# Altium project Arm_Control.PrjPcb
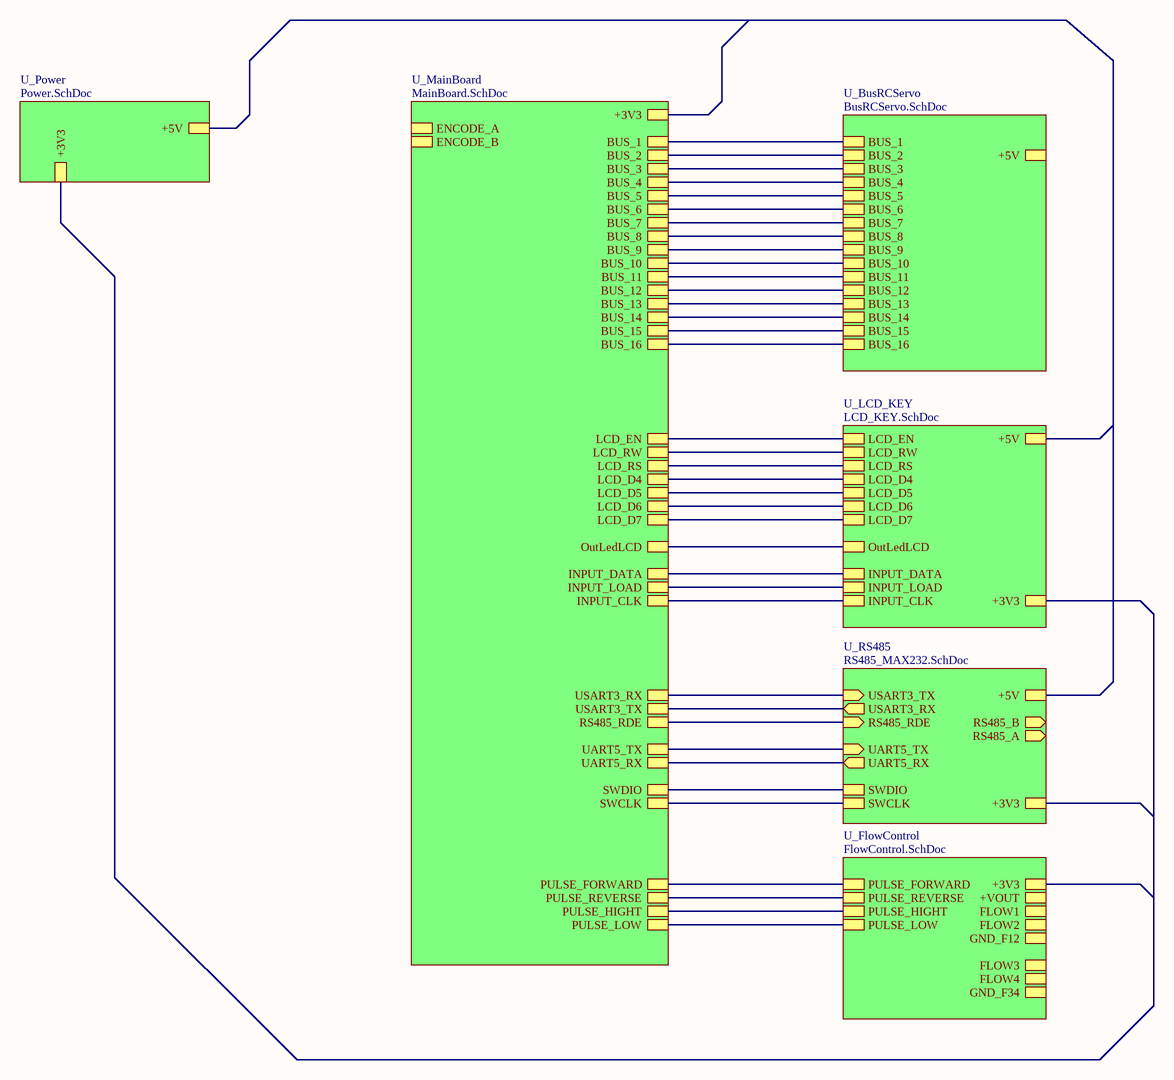
[diagram p0: ArmControl.SchDoc]
7 sheets, 117 parts. Net scope: hierarchical (ports join the sheet entries above them; power ports are global).
Sheets:
  ArmControl.SchDoc
    U_BusRCServo = BusRCServo.SchDoc
    U_Power = Power.SchDoc
    U_LCD_KEY = LCD_KEY.SchDoc
    U_FlowControl = FlowControl.SchDoc
    U_MainBoard = MainBoard.SchDoc
    U_RS485 = RS485_MAX232.SchDoc

## Sheet ArmControl.SchDoc
size B; SheetNumber: 1; SheetTotal: 8

### Sub-sheets
U_BusRCServo = BusRCServo.SchDoc: BUS_1, BUS_2, BUS_3, BUS_4, BUS_5, BUS_6, BUS_7, BUS_8, BUS_9, BUS_10, BUS_11, BUS_12, BUS_13, BUS_14, BUS_15, BUS_16, +5V
U_FlowControl = FlowControl.SchDoc: +3V3, +VOUT, PULSE_FORWARD, FLOW2, GND_F12, FLOW1, PULSE_REVERSE, PULSE_HIGHT, FLOW4, GND_F34, FLOW3, PULSE_LOW
U_LCD_KEY = LCD_KEY.SchDoc: LCD_EN, LCD_RW, LCD_RS, LCD_D4, LCD_D5, LCD_D6, LCD_D7, +5V, OutLedLCD, +3V3, INPUT_DATA, INPUT_LOAD, INPUT_CLK
U_MainBoard = MainBoard.SchDoc: ENCODE_A, ENCODE_B, BUS_5, BUS_6, BUS_2, BUS_3, BUS_4, BUS_11, BUS_12, BUS_9, BUS_10, BUS_13, BUS_14, BUS_15, BUS_16, BUS_1, BUS_7, BUS_8, LCD_D4, LCD_D5, LCD_D6, LCD_D7, LCD_EN, LCD_RW, LCD_RS, INPUT_DATA, INPUT_LOAD, INPUT_CLK, SWDIO, SWCLK, +3V3, RS485_RDE, USART3_RX, USART3_TX, PULSE_LOW, OutLedLCD, PULSE_HIGHT, PULSE_REVERSE, PULSE_FORWARD, UART5_TX, UART5_RX
U_Power = Power.SchDoc: +3V3, +5V
U_RS485 = RS485_MAX232.SchDoc: USART3_RX (out), USART3_TX (in), RS485_A (out), RS485_B (out), RS485_RDE (in), +5V, SWCLK, UART5_RX (out), UART5_TX (in), SWDIO, +3V3

### Nets
+3V3: sheet U_Power/+3V3, sheet U_LCD_KEY/+3V3, sheet U_FlowControl/+3V3, sheet U_MainBoard/+3V3, sheet U_RS485/+3V3
+5V: sheet U_BusRCServo/+5V, sheet U_Power/+5V, sheet U_LCD_KEY/+5V, sheet U_RS485/+5V
NetJP?_5: sheet U_MainBoard/SWDIO, sheet U_RS485/SWDIO
NetJP?_6: sheet U_MainBoard/SWCLK, sheet U_RS485/SWCLK
NetP1_2: sheet U_LCD_KEY/INPUT_CLK, sheet U_MainBoard/INPUT_CLK
NetP1_3: sheet U_LCD_KEY/INPUT_LOAD, sheet U_MainBoard/INPUT_LOAD
NetP1_4: sheet U_LCD_KEY/INPUT_DATA, sheet U_MainBoard/INPUT_DATA
NetP2_1: sheet U_BusRCServo/BUS_1, sheet U_MainBoard/BUS_1
NetP2_2: sheet U_BusRCServo/BUS_4, sheet U_MainBoard/BUS_4
NetP2_7: sheet U_BusRCServo/BUS_2, sheet U_MainBoard/BUS_2
NetP2_8: sheet U_BusRCServo/BUS_5, sheet U_MainBoard/BUS_5
NetP2_13: sheet U_BusRCServo/BUS_3, sheet U_MainBoard/BUS_3
NetP2_14: sheet U_BusRCServo/BUS_6, sheet U_MainBoard/BUS_6
NetP3_1: sheet U_BusRCServo/BUS_7, sheet U_MainBoard/BUS_7
NetP3_2: sheet U_BusRCServo/BUS_10, sheet U_MainBoard/BUS_10
NetP3_7: sheet U_BusRCServo/BUS_8, sheet U_MainBoard/BUS_8
NetP3_8: sheet U_BusRCServo/BUS_11, sheet U_MainBoard/BUS_11
NetP3_13: sheet U_BusRCServo/BUS_9, sheet U_MainBoard/BUS_9
NetP3_14: sheet U_BusRCServo/BUS_12, sheet U_MainBoard/BUS_12
NetP4_1: sheet U_BusRCServo/BUS_13, sheet U_MainBoard/BUS_13
NetP4_2: sheet U_BusRCServo/BUS_16, sheet U_MainBoard/BUS_16
NetP4_7: sheet U_BusRCServo/BUS_14, sheet U_MainBoard/BUS_14
NetP4_13: sheet U_BusRCServo/BUS_15, sheet U_MainBoard/BUS_15
NetPLCD1_1: sheet U_LCD_KEY/LCD_EN, sheet U_MainBoard/LCD_EN
NetPLCD1_2: sheet U_LCD_KEY/LCD_RW, sheet U_MainBoard/LCD_RW
NetPLCD1_3: sheet U_LCD_KEY/LCD_RS, sheet U_MainBoard/LCD_RS
NetPLCD2_3: sheet U_LCD_KEY/LCD_D7, sheet U_MainBoard/LCD_D7
NetPLCD2_4: sheet U_LCD_KEY/LCD_D6, sheet U_MainBoard/LCD_D6
NetPLCD2_5: sheet U_LCD_KEY/LCD_D5, sheet U_MainBoard/LCD_D5
NetPLCD2_6: sheet U_LCD_KEY/LCD_D4, sheet U_MainBoard/LCD_D4
NetR23_1: sheet U_LCD_KEY/OutLedLCD, sheet U_MainBoard/OutLedLCD
NetR43_1: sheet U_MainBoard/USART3_TX, sheet U_RS485/USART3_RX
NetR44_1: sheet U_MainBoard/USART3_RX, sheet U_RS485/USART3_TX
NetR50_2: sheet U_MainBoard/UART5_RX, sheet U_RS485/UART5_RX
NetR51_1: sheet U_MainBoard/UART5_TX, sheet U_RS485/UART5_TX
NetU1_29: sheet U_FlowControl/PULSE_FORWARD, sheet U_MainBoard/PULSE_FORWARD
NetU1_30: sheet U_FlowControl/PULSE_REVERSE, sheet U_MainBoard/PULSE_REVERSE
NetU1_33: sheet U_FlowControl/PULSE_HIGHT, sheet U_MainBoard/PULSE_HIGHT
NetU1_34: sheet U_FlowControl/PULSE_LOW, sheet U_MainBoard/PULSE_LOW
NetU1_55: sheet U_MainBoard/RS485_RDE, sheet U_RS485/RS485_RDE

## Sheet BusRCServo.SchDoc
size A; SheetNumber: 6; SheetTotal: 8
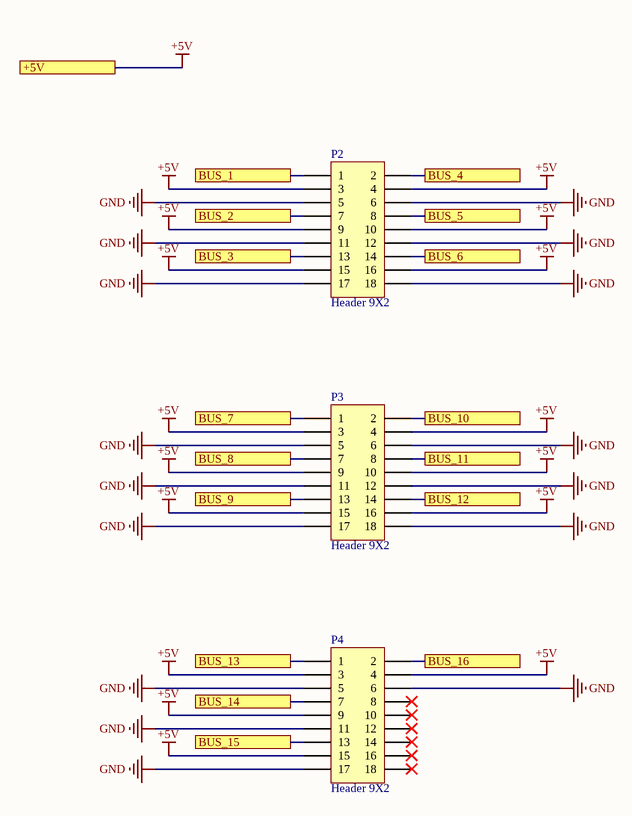
[diagram p1: BusRCServo.SchDoc]

### Parts
P2  Header 9X2  [HDR2X9]
P3  Header 9X2  [HDR2X9]
P4  Header 9X2  [HDR2X9]

### Ports
+5V, BUS_1, BUS_2, BUS_3, BUS_4, BUS_5, BUS_6, BUS_7, BUS_8, BUS_9, BUS_10, BUS_11, BUS_12, BUS_13, BUS_14, BUS_15, BUS_16

### Nets
+5V: P2.3 P2.4 P2.9 P2.10 P2.15 P2.16 P3.3 P3.4 P3.9 P3.10 P3.15 P3.16 P4.3 P4.4 P4.9 P4.15 ; port +5V
GND: P2.5 P2.6 P2.11 P2.12 P2.17 P2.18 P3.5 P3.6 P3.11 P3.12 P3.17 P3.18 P4.5 P4.6 P4.11 P4.17
NetP2_1: P2.1 ; port BUS_1
NetP2_2: P2.2 ; port BUS_4
NetP2_7: P2.7 ; port BUS_2
NetP2_8: P2.8 ; port BUS_5
NetP2_13: P2.13 ; port BUS_3
NetP2_14: P2.14 ; port BUS_6
NetP3_1: P3.1 ; port BUS_7
NetP3_2: P3.2 ; port BUS_10
NetP3_7: P3.7 ; port BUS_8
NetP3_8: P3.8 ; port BUS_11
NetP3_13: P3.13 ; port BUS_9
NetP3_14: P3.14 ; port BUS_12
NetP4_1: P4.1 ; port BUS_13
NetP4_2: P4.2 ; port BUS_16
NetP4_7: P4.7 ; port BUS_14
NetP4_13: P4.13 ; port BUS_15

Not connected (* = marked no-connect by the designer): P4 8* 10* 12* 14* 16* 18*

### Library data of the parts
P2-P4 = Header 9X2: Header, 9-Pin, Dual row; LatestRevisionDate: 17-Jul-2002; LatestRevisionNote: Re-released for DXP Platform.; Publisher: Altium Limited

## Sheet Power.SchDoc
size A; SheetNumber: 3; SheetTotal: 7
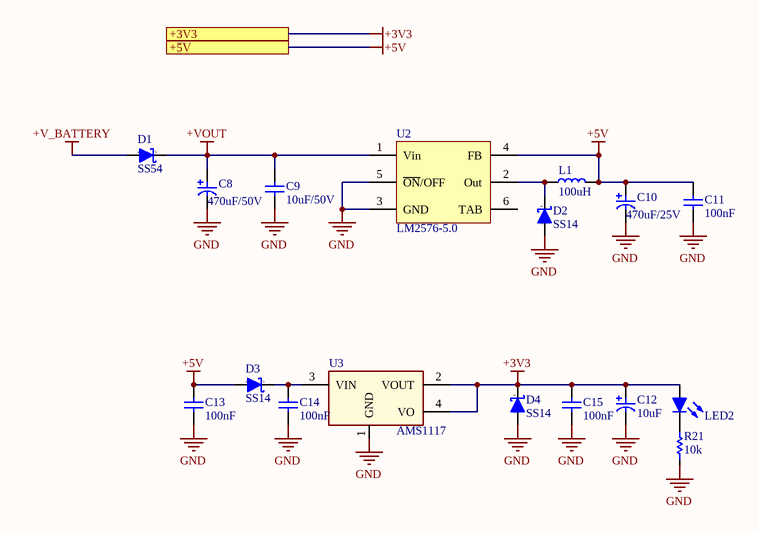
[diagram p2: Power.SchDoc]

### Parts
C8  470uF/50V  [C SMD ALU (G)]
C9  10uF/50V  [C 0603 (1608)]
C10  470uF/25V  [C SMD ALU (G)]
C11  100nF  [C 0603 (1608)]
C12  10uF  [C SMD ALU (B)]
C13  100nF  [C 0603 (1608)]
C14  100nF  [C 0603 (1608)]
C15  100nF  [C 0603 (1608)]
D1  SS54  [DO-214AC (SMA)]
D2  SS14  [DO-214AC (SMA)]
D3  SS14  [DO-214AC (SMA)]
D4  SS14  [DO-214AC (SMA)]
L1  100uH  [Inductor SMD 0805 (2012)]
LED2  Led  [Led SMD 0603]  (value not drawn)
R21  10k  [R 0603 (1608)]
U2  LM2576-5.0  [TO-263-5]
U3  AMS1117  [SOT-223]

### Ports
+3V3, +5V

### Nets
+3V3: C12.1 C15.1 D4.1(A) LED2.2(A) U3.2(VOUT) U3.4(VO) ; port +3V3
+5V: C10.1 C11.1 C13.1 D3.2(K) L1.2 U2.4(FB) ; port +5V
+V_BATTERY: D1.2(K)
+VOUT: C8.1 C9.1 D1.1(A) U2.1(Vin)
GND: C8.2 C9.2 C10.2 C11.2 C12.2 C13.2 C14.2 C15.2 D2.2(K) D4.2(K) R21.1 U2.3(GND) U2.5(~{ON}/OFF) U3.1(GND)
NetC14_1: C14.1 D3.1(A) U3.3(VIN)
NetD2_1: D2.1(A) L1.1 U2.2(Out)
NetLED2_1: LED2.1(K) R21.2

Not connected (* = marked no-connect by the designer): U2 6(TAB)

### Notes on the sheet
- (in symbol Diode Schottky) a; k

### Library data of the parts
C8 C10 C12 = Capacitor: Capacitor pol
C9 C11 C13-C15 = Capacitor NP: Capacitor non-pol
D1-D4 = Diode Schottky: Schottky Diode; Published: 8-Jun-2000; LatestRevisionDate: 17-Jul-2002; LatestRevisionNote: Re-released for DXP Platform.; PackageReference: SMB; Publisher: Altium Limited; Code_JEDEC: DO-214-AA
L1 = Inductor
LED2 = Led: Typical LED
R21 = Resistor: Published: 8-Jun-2000; LatestRevisionDate: 17-Jul-2002; LatestRevisionNote: Re-released for DXP Platform.; PackageReference: AXIAL-0.3; Publisher: Altium Limited
U2 = LM2576/96: SIMPLE SWITCHER® 3A Step-Down Voltage Regulator
U3 = AMS1117: 1A LDO Voltage Regulator, ADJ or fixed 1.5/1.8/2.5/2.85/3.3/5V

## Sheet LCD_KEY.SchDoc
size A; SheetNumber: 4; SheetTotal: 8
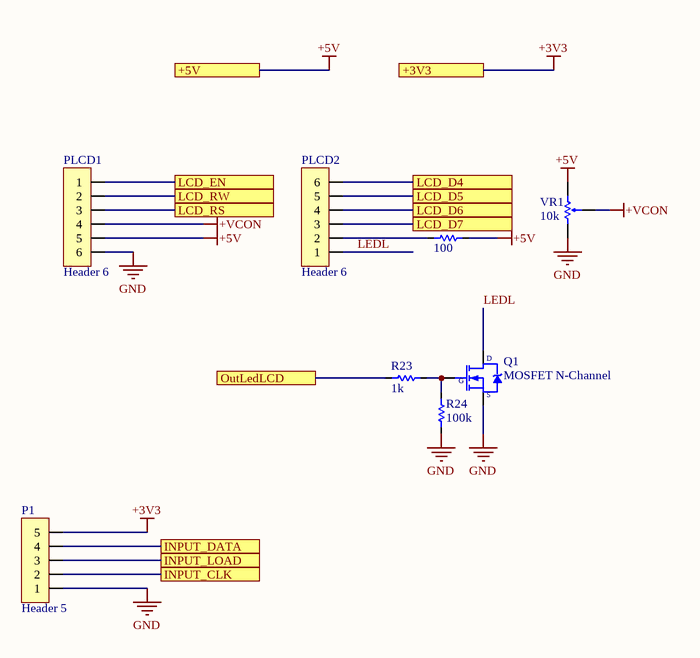
[diagram p3: LCD_KEY.SchDoc]

### Parts
P1  Header 5  [Header 5]
PLCD1  Header 6  [XH2.54-6P]
PLCD2  Header 6  [XH2.54-6P]
Q1  MOSFET N-Channel  [SOT-23]
R22  100  [R 0603 (1608)]
R23  1k  [R 0603 (1608)]
R24  100k  [R 0603 (1608)]
VR1  10k  [R VAR A]

### Ports
+3V3, +5V, INPUT_CLK, INPUT_DATA, INPUT_LOAD, LCD_D4, LCD_D5, LCD_D6, LCD_D7, LCD_EN, LCD_RS, LCD_RW, OutLedLCD

### Nets
+3V3: P1.5 ; port +3V3
+5V: PLCD1.5 R22.2 VR1.1 ; port +5V
+VCON: PLCD1.4 VR1.2
GND: P1.1 PLCD1.6 Q1.2(S) R24.1 VR1.3
LEDL: PLCD2.1 Q1.3(D)
NetP1_2: P1.2 ; port INPUT_CLK
NetP1_3: P1.3 ; port INPUT_LOAD
NetP1_4: P1.4 ; port INPUT_DATA
NetPLCD1_1: PLCD1.1 ; port LCD_EN
NetPLCD1_2: PLCD1.2 ; port LCD_RW
NetPLCD1_3: PLCD1.3 ; port LCD_RS
NetPLCD2_2: PLCD2.2 R22.1
NetPLCD2_3: PLCD2.3 ; port LCD_D7
NetPLCD2_4: PLCD2.4 ; port LCD_D6
NetPLCD2_5: PLCD2.5 ; port LCD_D5
NetPLCD2_6: PLCD2.6 ; port LCD_D4
NetQ1_1: Q1.1(G) R23.2 R24.2
NetR23_1: R23.1 ; port OutLedLCD

### Library data of the parts
P1 = Header 5: Header, 5-Pin; LatestRevisionDate: 17-Jul-2002; LatestRevisionNote: Re-released for DXP Platform.; Publisher: Altium Limited
PLCD1 PLCD2 = Header 6: Header, 6-Pin
R22-R24 = Resistor: Published: 8-Jun-2000; LatestRevisionDate: 17-Jul-2002; LatestRevisionNote: Re-released for DXP Platform.; PackageReference: AXIAL-0.3; Publisher: Altium Limited
VR1 = Resistor Variable: Manufacturer: Omron Automation and Safety; Manufacturer Part Number: G3MB-202P DC5; Circuit: SPST-NO (1 Form A); Output Type: AC, Zero Cross; Load Current: 2A; Voltage - Input: 4 ~ 6VDC; Voltage - Load: 75 ~ 264 V; Relay Type: Relay; RoHS: RoHS Compliant; Category: Relays; Packaging: Bulk; Part Status: Obsolete; On-State Resistance (Max): -; Mounting Type: Through Hole; Termination Style: PC Pin; Package / Case: 4-SIP; Supplier Device Package: 4-SIP; ComponentLink1URL: http://media.digikey.com/pdf/Data%20Sheets/Omron%20PDFs/G3MB.pdf; ComponentLink1Description: http://media.digikey.com/pdf/Data%20Sheets/Omron%20PDFs/G3MB.pdf

## Sheet FlowControl.SchDoc
size B; SheetNumber: 5; SheetTotal: 7
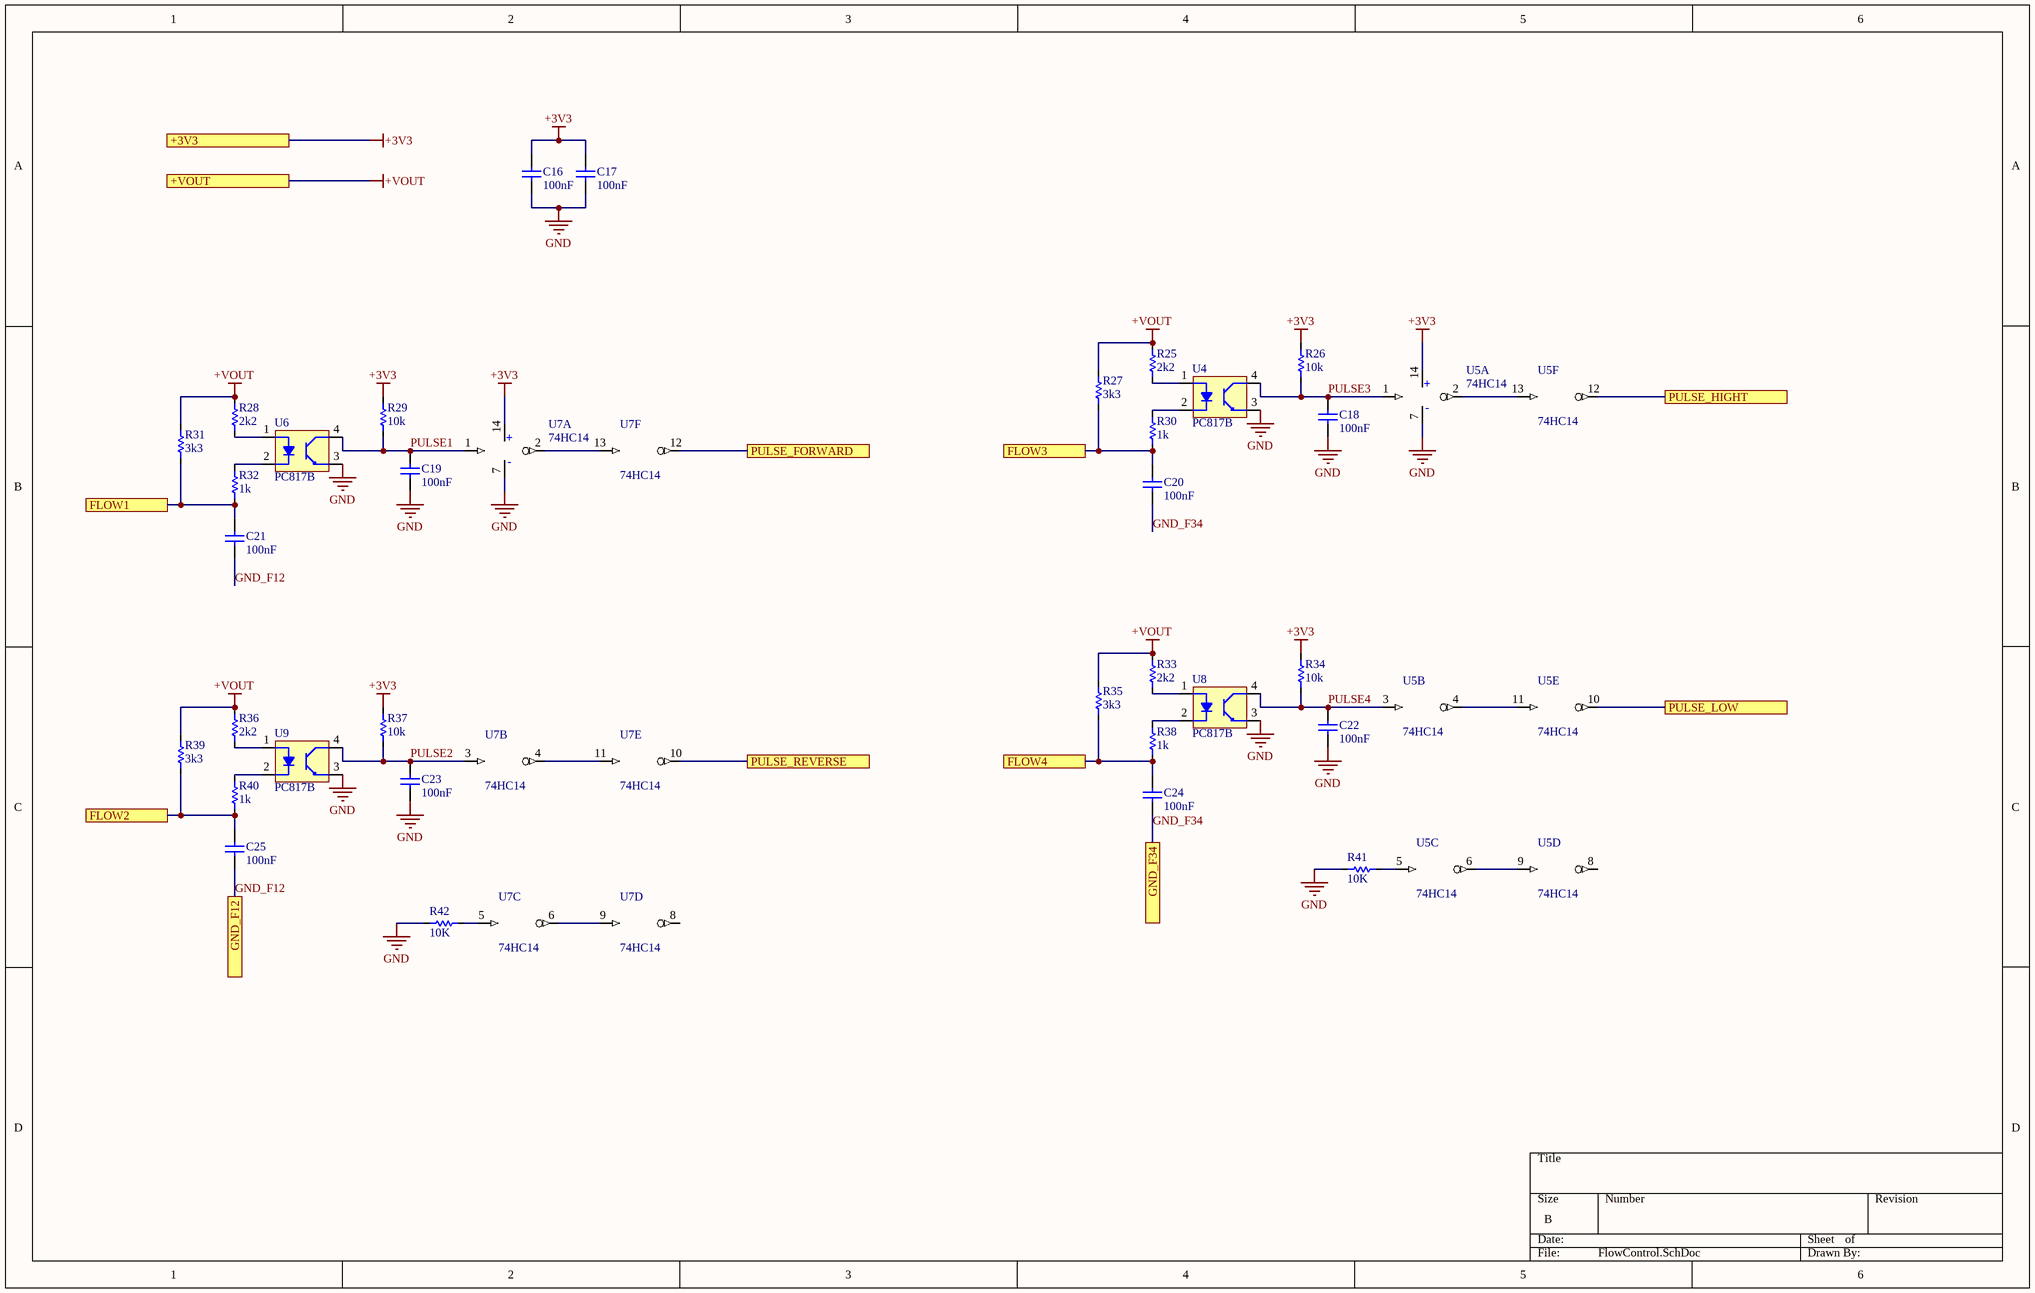
[diagram p4: FlowControl.SchDoc]

### Parts
C16  100nF  [C 0603 (1608)]
C17  100nF  [C 0603 (1608)]
C18  100nF  [C 0603 (1608)]
C19  100nF  [C 0603 (1608)]
C20  100nF  [C 0603 (1608)]
C21  100nF  [C 0603 (1608)]
C22  100nF  [C 0603 (1608)]
C23  100nF  [C 0603 (1608)]
C24  100nF  [C 0603 (1608)]
C25  100nF  [C 0603 (1608)]
R25  2k2  [R 0603 (1608)]
R26  10k  [R 0603 (1608)]
R27  3k3  [R 0603 (1608)]
R28  2k2  [R 0603 (1608)]
R29  10k  [R 0603 (1608)]
R30  1k  [R 0603 (1608)]
R31  3k3  [R 0603 (1608)]
R32  1k  [R 0603 (1608)]
R33  2k2  [R 0603 (1608)]
R34  10k  [R 0603 (1608)]
R35  3k3  [R 0603 (1608)]
R36  2k2  [R 0603 (1608)]
R37  10k  [R 0603 (1608)]
R38  1k  [R 0603 (1608)]
R39  3k3  [R 0603 (1608)]
R40  1k  [R 0603 (1608)]
R41  10K  [R 0603 (1608)]
R42  10K  [R 0603 (1608)]
U4  PC817B  [DIP 4]
U5  74HC14  [SOIC-14]  (parts A,B,C,D,E,F of 6)
U6  PC817B  [DIP 4]
U7  74HC14  [SOIC-14]  (parts A,B,C,D,E,F of 6)
U8  PC817B  [DIP 4]
U9  PC817B  [DIP 4]

### Ports
+3V3, +VOUT, FLOW1, FLOW2, FLOW3, FLOW4, GND_F12, GND_F34, PULSE_FORWARD, PULSE_HIGHT, PULSE_LOW, PULSE_REVERSE

### Nets
+3V3: C16.1 C17.1 R26.2 R29.2 R34.2 R37.2 U5.14(+) U7.14(+) ; port +3V3
+VOUT: R25.2 R27.2 R28.2 R31.2 R33.2 R35.2 R36.2 R39.2 ; port +VOUT
GND: C16.2 C17.2 C18.2 C19.2 C22.2 C23.2 R41.2 R42.2 U4.3(E) U5.7(GND) U6.3(E) U7.7(GND) U8.3(E) U9.3(E)
GND_F12: C21.2 C25.2 ; port GND_F12
GND_F34: C20.2 C24.2 ; port GND_F34
PULSE1: C19.1 R29.1 U6.4(C) U7.1(1A)
PULSE2: C23.1 R37.1 U7.3(2A) U9.4(C)
PULSE3: C18.1 R26.1 U4.4(C) U5.1(1A)
PULSE4: C22.1 R34.1 U5.3(2A) U8.4(C)
NetC20_1: C20.1 R27.1 R30.1 ; port FLOW3
NetC21_1: C21.1 R31.1 R32.1 ; port FLOW1
NetC24_1: C24.1 R35.1 R38.1 ; port FLOW4
NetC25_1: C25.1 R39.1 R40.1 ; port FLOW2
NetR25_1: R25.1 U4.1(A)
NetR28_1: R28.1 U6.1(A)
NetR30_2: R30.2 U4.2(K)
NetR32_2: R32.2 U6.2(K)
NetR33_1: R33.1 U8.1(A)
NetR36_1: R36.1 U9.1(A)
NetR38_2: R38.2 U8.2(K)
NetR40_2: R40.2 U9.2(K)
NetR41_1: R41.1 U5.5(3A)
NetR42_1: R42.1 U7.5(3A)
NetU1_29: U7.12(6Y) ; port PULSE_FORWARD
NetU1_30: U7.10(5Y) ; port PULSE_REVERSE
NetU1_33: U5.12(6Y) ; port PULSE_HIGHT
NetU1_34: U5.10(5Y) ; port PULSE_LOW
NetU5_2: U5.2(1Y) U5.13(6A)
NetU5_4: U5.4(2Y) U5.11(5A)
NetU5_6: U5.6(3Y) U5.9(4A)
NetU7_2: U7.2(1Y) U7.13(6A)
NetU7_4: U7.4(2Y) U7.11(5A)
NetU7_6: U7.6(3Y) U7.9(4A)

Not connected (* = marked no-connect by the designer): U5 8(4Y); U7 8(4Y)

### Notes on the sheet
- (in symbol 74HC14, part A) -

### Library data of the parts
C16-C25 = Capacitor NP: Capacitor non-pol
R25-R42 = Resistor: Published: 8-Jun-2000; LatestRevisionDate: 17-Jul-2002; LatestRevisionNote: Re-released for DXP Platform.; PackageReference: AXIAL-0.3; Publisher: Altium Limited
U4 U6 U8 U9 = Opto PC817B
U5 U7 = 74HC14: Hex inverting Schmitt trigger

## Sheet MainBoard.SchDoc
size A2; SheetNumber: 2; SheetTotal: 7
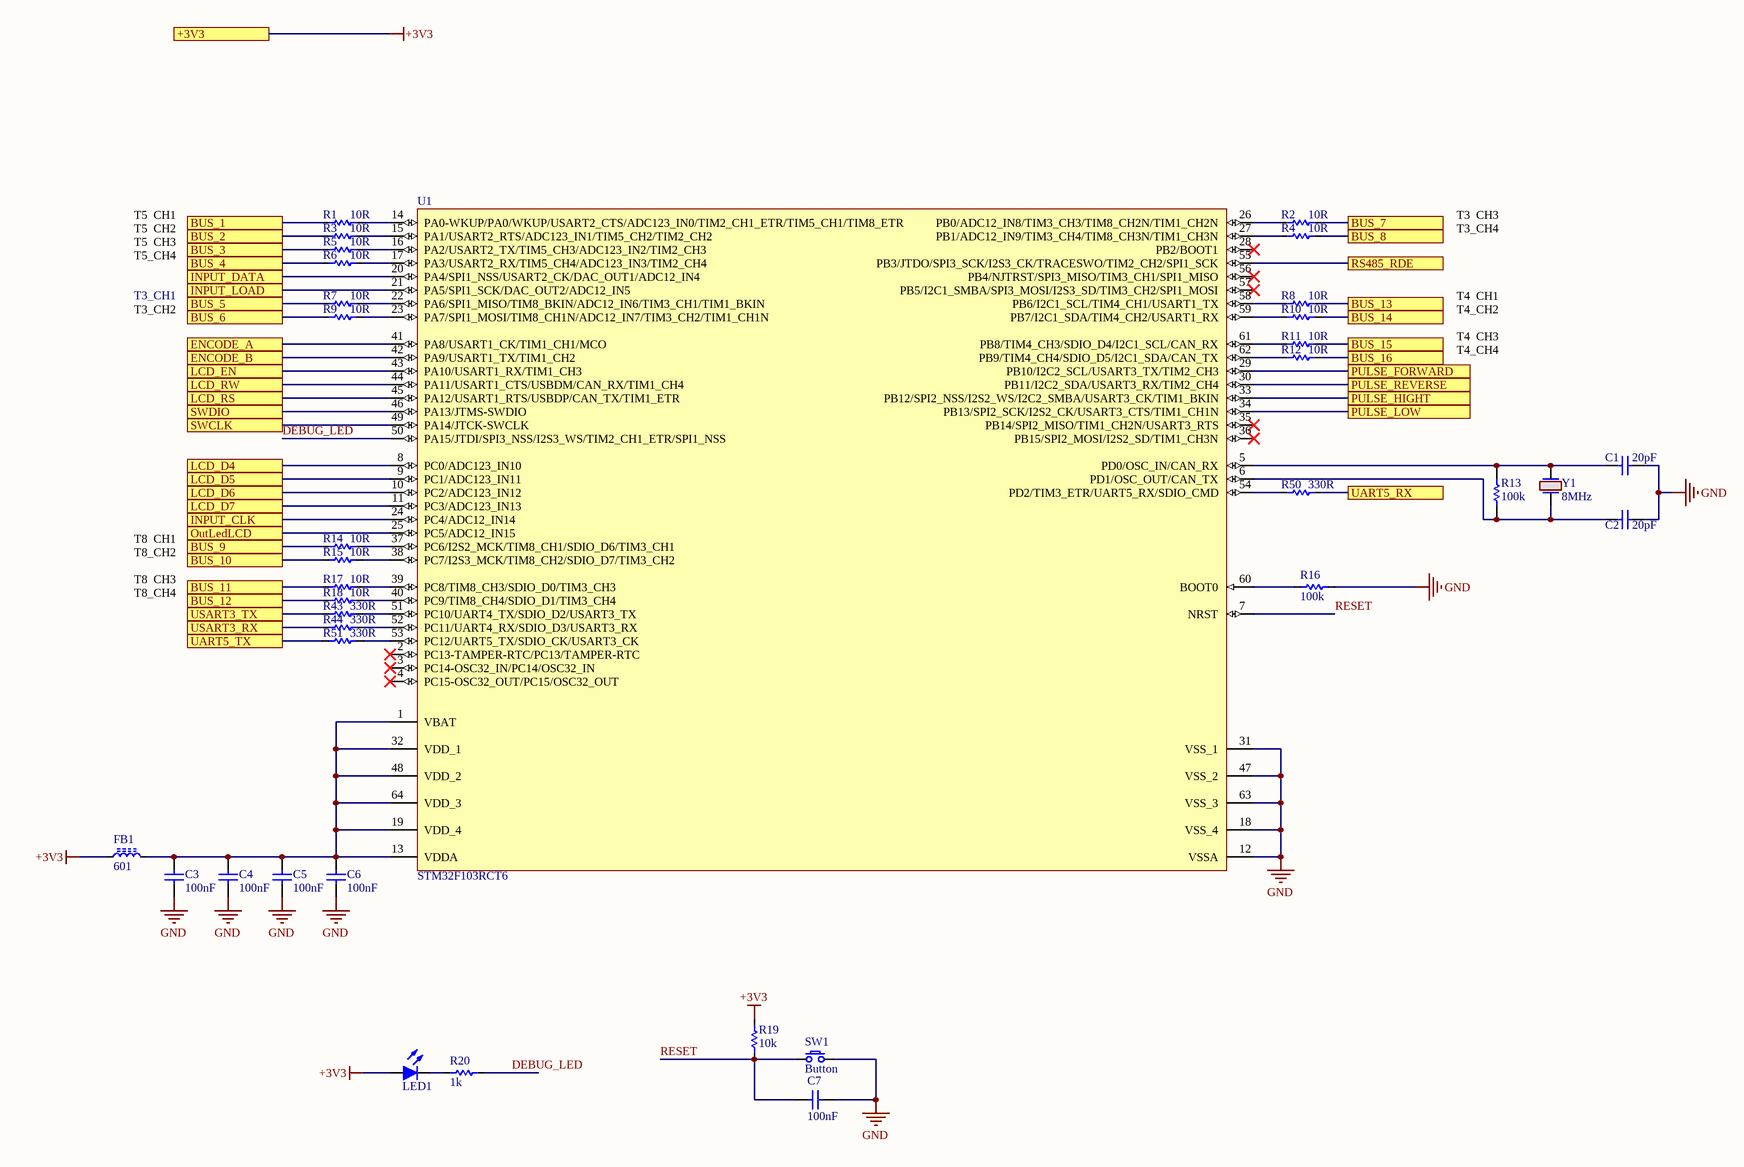
[diagram p5: MainBoard.SchDoc]

### Parts
C1  20pF  [C 0603 (1608)]
C2  20pF  [C 0603 (1608)]
C3  100nF  [C 0805 (2012)]
C4  100nF  [C 0805 (2012)]
C5  100nF  [C 0805 (2012)]
C6  100nF  [C 0805 (2012)]
C7  100nF  [C 0805 (2012)]
FB1  601  [Inductor SMD 0805 (2012)]
LED1  Led  [Led SMD 0603]  (value not drawn)
R1  10R  [R 0603 (1608)]
R2  10R  [R 0603 (1608)]
R3  10R  [R 0603 (1608)]
R4  10R  [R 0603 (1608)]
R5  10R  [R 0603 (1608)]
R6  10R  [R 0603 (1608)]
R7  10R  [R 0603 (1608)]
R8  10R  [R 0603 (1608)]
R9  10R  [R 0603 (1608)]
R10  10R  [R 0603 (1608)]
R11  10R  [R 0603 (1608)]
R12  10R  [R 0603 (1608)]
R13  100k  [R 0603 (1608)]
R14  10R  [R 0603 (1608)]
R15  10R  [R 0603 (1608)]
R16  100k  [R 0603 (1608)]
R17  10R  [R 0603 (1608)]
R18  10R  [R 0603 (1608)]
R19  10k  [R 0805 (2012)]
R20  1k  [R 0603 (1608)]
R43  330R  [R 0603 (1608)]
R44  330R  [R 0603 (1608)]
R50  330R  [R 0603 (1608)]
R51  330R  [R 0603 (1608)]
SW1  Button  [SW/2/SMD]
U1  STM32F103RCT6  [LQFP64_N]
Y1  8MHz  [Crystal SMD FC135]

### Ports
+3V3, BUS_1, BUS_2, BUS_3, BUS_4, BUS_5, BUS_6, BUS_7, BUS_8, BUS_9, BUS_10, BUS_11, BUS_12, BUS_13, BUS_14, BUS_15, BUS_16, ENCODE_A, ENCODE_B, INPUT_CLK, INPUT_DATA, INPUT_LOAD, LCD_D4, LCD_D5, LCD_D6, LCD_D7, LCD_EN, LCD_RS, LCD_RW, OutLedLCD, PULSE_FORWARD, PULSE_HIGHT, PULSE_LOW, PULSE_REVERSE, RS485_RDE, SWCLK, SWDIO, UART5_RX, UART5_TX, USART3_RX, USART3_TX

### Nets
+3V3: FB1.1 LED1.2(A) R19.2 ; port +3V3
GND: C1.2 C2.2 C3.2 C4.2 C5.2 C6.2 C7.2 R16.2 SW1.2 U1.12(VSSA) U1.18(VSS_4) U1.31(VSS_1) U1.47(VSS_2) U1.63(VSS_3)
DEBUG_LED: R20.2 U1.50(PA15/JTDI/SPI3_NSS/I2S3_WS/TIM2_CH1_ETR/SPI1_NSS)
RESET: C7.1 R19.1 SW1.1 U1.7(NRST)
NetC1_1: C1.1 R13.2 U1.5(PD0/OSC_IN/CAN_RX) Y1.2
NetC2_1: C2.1 R13.1 U1.6(PD1/OSC_OUT/CAN_TX) Y1.1
NetC3_1: C3.1 C4.1 C5.1 C6.1 FB1.2 U1.1(VBAT) U1.13(VDDA) U1.19(VDD_4) U1.32(VDD_1) U1.48(VDD_2) U1.64(VDD_3)
NetJP?_5: U1.46(PA13/JTMS-SWDIO) ; port SWDIO
NetJP?_6: U1.49(PA14/JTCK-SWCLK) ; port SWCLK
NetLED1_1: LED1.1(K) R20.1
NetP1_2: U1.24(PC4/ADC12_IN14) ; port INPUT_CLK
NetP1_3: U1.21(PA5/SPI1_SCK/DAC_OUT2/ADC12_IN5) ; port INPUT_LOAD
NetP1_4: U1.20(PA4/SPI1_NSS/USART2_CK/DAC_OUT1/ADC12_IN4) ; port INPUT_DATA
NetP2_1: R1.1 ; port BUS_1
NetP2_2: R6.1 ; port BUS_4
NetP2_7: R3.1 ; port BUS_2
NetP2_8: R7.1 ; port BUS_5
NetP2_13: R5.1 ; port BUS_3
NetP2_14: R9.1 ; port BUS_6
NetP3_1: R2.2 ; port BUS_7
NetP3_2: R15.1 ; port BUS_10
NetP3_7: R4.2 ; port BUS_8
NetP3_8: R17.1 ; port BUS_11
NetP3_13: R14.1 ; port BUS_9
NetP3_14: R18.1 ; port BUS_12
NetP4_1: R8.2 ; port BUS_13
NetP4_2: R12.2 ; port BUS_16
NetP4_7: R10.2 ; port BUS_14
NetP4_13: R11.2 ; port BUS_15
NetPLCD1_1: U1.43(PA10/USART1_RX/TIM1_CH3) ; port LCD_EN
NetPLCD1_2: U1.44(PA11/USART1_CTS/USBDM/CAN_RX/TIM1_CH4) ; port LCD_RW
NetPLCD1_3: U1.45(PA12/USART1_RTS/USBDP/CAN_TX/TIM1_ETR) ; port LCD_RS
NetPLCD2_3: U1.11(PC3/ADC123_IN13) ; port LCD_D7
NetPLCD2_4: U1.10(PC2/ADC123_IN12) ; port LCD_D6
NetPLCD2_5: U1.9(PC1/ADC123_IN11) ; port LCD_D5
NetPLCD2_6: U1.8(PC0/ADC123_IN10) ; port LCD_D4
NetR1_2: R1.2 U1.14(PA0-WKUP/PA0/WKUP/USART2_CTS/ADC123_IN0/TIM2_CH1_ETR/TIM5_CH1/TIM8_ETR)
NetR2_1: R2.1 U1.26(PB0/ADC12_IN8/TIM3_CH3/TIM8_CH2N/TIM1_CH2N)
NetR3_2: R3.2 U1.15(PA1/USART2_RTS/ADC123_IN1/TIM5_CH2/TIM2_CH2)
NetR4_1: R4.1 U1.27(PB1/ADC12_IN9/TIM3_CH4/TIM8_CH3N/TIM1_CH3N)
NetR5_2: R5.2 U1.16(PA2/USART2_TX/TIM5_CH3/ADC123_IN2/TIM2_CH3)
NetR6_2: R6.2 U1.17(PA3/USART2_RX/TIM5_CH4/ADC123_IN3/TIM2_CH4)
NetR7_2: R7.2 U1.22(PA6/SPI1_MISO/TIM8_BKIN/ADC12_IN6/TIM3_CH1/TIM1_BKIN)
NetR8_1: R8.1 U1.58(PB6/I2C1_SCL/TIM4_CH1/USART1_TX)
NetR9_2: R9.2 U1.23(PA7/SPI1_MOSI/TIM8_CH1N/ADC12_IN7/TIM3_CH2/TIM1_CH1N)
NetR10_1: R10.1 U1.59(PB7/I2C1_SDA/TIM4_CH2/USART1_RX)
NetR11_1: R11.1 U1.61(PB8/TIM4_CH3/SDIO_D4/I2C1_SCL/CAN_RX)
NetR12_1: R12.1 U1.62(PB9/TIM4_CH4/SDIO_D5/I2C1_SDA/CAN_TX)
NetR14_2: R14.2 U1.37(PC6/I2S2_MCK/TIM8_CH1/SDIO_D6/TIM3_CH1)
NetR15_2: R15.2 U1.38(PC7/I2S3_MCK/TIM8_CH2/SDIO_D7/TIM3_CH2)
NetR16_1: R16.1 U1.60(BOOT0)
NetR17_2: R17.2 U1.39(PC8/TIM8_CH3/SDIO_D0/TIM3_CH3)
NetR18_2: R18.2 U1.40(PC9/TIM8_CH4/SDIO_D1/TIM3_CH4)
NetR23_1: U1.25(PC5/ADC12_IN15) ; port OutLedLCD
NetR43_1: R43.1 ; port USART3_TX
NetR43_2: R43.2 U1.51(PC10/UART4_TX/SDIO_D2/USART3_TX)
NetR44_1: R44.1 ; port USART3_RX
NetR44_2: R44.2 U1.52(PC11/UART4_RX/SDIO_D3/USART3_RX)
NetR50_1: R50.1 U1.54(PD2/TIM3_ETR/UART5_RX/SDIO_CMD)
NetR50_2: R50.2 ; port UART5_RX
NetR51_1: R51.1 ; port UART5_TX
NetR51_2: R51.2 U1.53(PC12/UART5_TX/SDIO_CK/USART3_CK)
NetU1_29: U1.29(PB10/I2C2_SCL/USART3_TX/TIM2_CH3) ; port PULSE_FORWARD
NetU1_30: U1.30(PB11/I2C2_SDA/USART3_RX/TIM2_CH4) ; port PULSE_REVERSE
NetU1_33: U1.33(PB12/SPI2_NSS/I2S2_WS/I2C2_SMBA/USART3_CK/TIM1_BKIN) ; port PULSE_HIGHT
NetU1_34: U1.34(PB13/SPI2_SCK/I2S2_CK/USART3_CTS/TIM1_CH1N) ; port PULSE_LOW
NetU1_41: U1.41(PA8/USART1_CK/TIM1_CH1/MCO) ; port ENCODE_A
NetU1_42: U1.42(PA9/USART1_TX/TIM1_CH2) ; port ENCODE_B
NetU1_55: U1.55(PB3/JTDO/SPI3_SCK/I2S3_CK/TRACESWO/TIM2_CH2/SPI1_SCK) ; port RS485_RDE

Not connected (* = marked no-connect by the designer): U1 2(PC13-TAMPER-RTC/PC13/TAMPER-RTC)* 3(PC14-OSC32_IN/PC14/OSC32_IN)* 4(PC15-OSC32_OUT/PC15/OSC32_OUT)* 28(PB2/BOOT1)* 35(PB14/SPI2_MISO/TIM1_CH2N/USART3_RTS)* 36(PB15/SPI2_MOSI/I2S2_SD/TIM1_CH3N)* 56(PB4/NJTRST/SPI3_MISO/TIM3_CH1/SPI1_MISO)* 57(PB5/I2C1_SMBA/SPI3_MOSI/I2S3_SD/TIM3_CH2/SPI1_MOSI)*

### Notes on the sheet
- T5_CH1
- T5_CH2
- T5_CH3
- T5_CH4
- T3_CH3
- T3_CH4
- T3_CH1
- T3_CH2
- T4_CH1
- T4_CH2
- T4_CH3
- T4_CH4
- T8_CH1
- T8_CH3
- T8_CH4
- T8_CH2

### Library data of the parts
C1-C7 = Capacitor NP: Capacitor non-pol
FB1 = Ferrite Breab
LED1 = Led: Typical LED
R1-R20 R43 R44 R50 R51 = Resistor: Published: 8-Jun-2000; LatestRevisionDate: 17-Jul-2002; LatestRevisionNote: Re-released for DXP Platform.; PackageReference: AXIAL-0.3; Publisher: Altium Limited
SW1 = SW SPST: Tact switch 2 pin
U1 = STM32F103RCT6: ARM Cortex-M3 32-bit MCU, 256 KB Flash, 48 KB Internal RAM, 51 I/Os, 64-pin LQFP, -40 to 85 degC, Tray; A/D Converter: 3x12-bit (16 Channel); D/A Converter: 2x12-bit (2 Channel); FLASH Size (Prog) (kB): 256; I/Os (High Current): 51; Internal RAM Size (kB): 48; Operating Frequency(F) (Processor speed) (MHz): 72; Supply Voltage(Vcc) min (V): 2; DatasheetVersion: Rev. 8; PackageVersion: Rev. 4, 06/2013; PackageReference: LQFP64; PackageDescription: 64-Pin Low Profile Quad Flat Package, 10 x 10 mm Body, 0.5 mm Pitch; Supplier 1: Digi-Key; Supplier Part Number 1: 497-9033-ND; Supplier 2: Newark; Supplier Part Number 2: 01P4099; Supplier 3: Newark; Supplier Part Number 3: 57P1227; Supplier 4: Mouser; Supplier Part Number 4: 511-STM32F103RCT6; Core: ARM Cortex-M3; Packing: Tray; Mounting Technology: Surface Mount; PartNumber: STM32F103RCT6; ComponentLink1Description: Manufacturer URL; ComponentLink1URL: http://www.st.com/web/en/home.html; ComponentLink2Description: Datasheet; ComponentLink2URL: http://www.st.com/st-web-ui/static/active/en/resource/technical/document/datasheet/CD00191185.pdf; ComponentLink3Description: Package Specification; ComponentLink3URL: http://www.st.com/st-web-ui/static/active/en/resource/technical/document/datasheet/DM00037051.pdf
Y1 = Crystal

## Sheet RS485_MAX232.SchDoc
size A; SheetNumber: 7; SheetTotal: 7
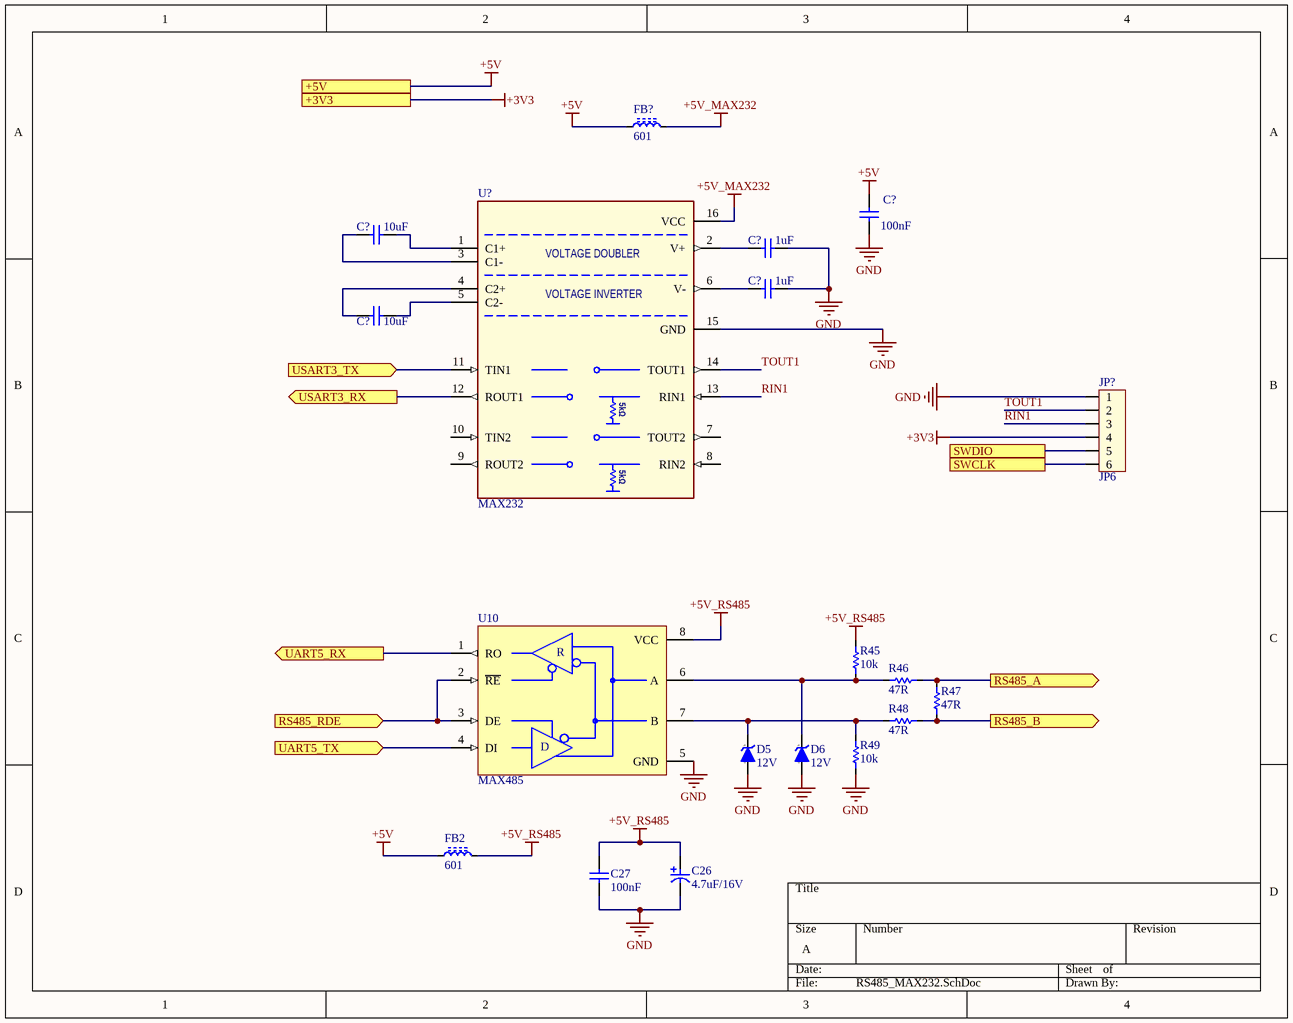
[diagram p6: RS485_MAX232.SchDoc]

### Parts
(Parts that share a designator on the sheet are numbered #1, #2 ... from top to bottom, then left to right.)
C26  4.7uF/16V  [C SMD ALU (B)]
C27  100nF  [C 0805 (2012)]
C?#1  10uF  [C 0603 (1608)]
C?#2  100nF  [C 0603 (1608)]
C?#3  1uF  [C 0603 (1608)]
C?#4  1uF  [C 0603 (1608)]
C?#5  10uF  [C 0603 (1608)]
D5  12V  [DO-214AC (SMA)]
D6  12V  [DO-214AC (SMA)]
FB2  601  [Inductor SMD 0805 (2012)]
FB?  601  [Inductor SMD 0805 (2012)]
JP?  JP6  [CON Header 6]
R45  10k  [R 0603 (1608)]
R46  47R  [R 0603 (1608)]
R47  47R  [R 0603 (1608)]
R48  47R  [R 0603 (1608)]
R49  10k  [R 0603 (1608)]
U10  MAX485  [DIP 8]
U?  MAX232  [SOIC-16]

### Ports
+3V3, +5V, RS485_A (out), RS485_B (out), RS485_RDE (in), SWCLK, SWDIO, UART5_RX (out), UART5_TX (in), USART3_RX (out), USART3_TX (in)

### Nets
+3V3: JP?.4 ; port +3V3
+5V: C?#2.2 FB2.1 FB?.1 ; port +5V
+5V_MAX232: FB?.2 U?.16(VCC)
+5V_RS485: C26.1 C27.1 FB2.2 R45.2 U10.8(VCC)
GND: C26.2 C27.2 C?#2.1 C?#3.2 C?#4.2 D5.2(K) D6.2(K) JP?.1 R49.1 U10.5(GND) U?.15(GND)
RIN1: JP?.3 U?.13(RIN1)
TOUT1: JP?.2 U?.14(TOUT1)
NetC?#1_1: C?#1.1 U?.3(C1-)
NetC?#1_2: C?#1.2 U?.1(C1+)
NetC?#3_1: C?#3.1 U?.2(V+)
NetC?#4_1: C?#4.1 U?.6(V-)
NetC?#5_1: C?#5.1 U?.4(C2+)
NetC?#5_2: C?#5.2 U?.5(C2-)
NetD5_1: D5.1(A) R48.2 R49.2 U10.7(B)
NetD6_1: D6.1(A) R45.1 R46.2 U10.6(A)
NetJP?_5: JP?.5 ; port SWDIO
NetJP?_6: JP?.6 ; port SWCLK
NetR43_1: U?.12(ROUT1) ; port USART3_RX
NetR44_1: U?.11(TIN1) ; port USART3_TX
NetR46_1: R46.1 R47.1 ; port RS485_A
NetR47_2: R47.2 R48.1 ; port RS485_B
NetR50_2: U10.1(RO) ; port UART5_RX
NetR51_1: U10.4(DI) ; port UART5_TX
NetU1_55: U10.2(~{RE}) U10.3(DE) ; port RS485_RDE

Not connected (* = marked no-connect by the designer): U? 7(TOUT2) 8(RIN2) 9(ROUT2) 10(TIN2)

### Notes on the sheet
- (in symbol Diode Zener) k; a
- (in symbol MAX232) VOLTAGE DOUBLER; VOLTAGE INVERTER; 5kΩ
- (in symbol MAX485) R; D

### Library data of the parts
C26 = Capacitor: Capacitor pol
C27 C?#1-C?#5 = Capacitor NP: Capacitor non-pol
D5 D6 = Diode Zener: Zener Diode; Published: 8-Jun-2000; LatestRevisionDate: 17-Jul-2002; LatestRevisionNote: Re-released for DXP Platform.; PackageReference: DIODE-0.7; Publisher: Altium Limited
FB2 FB? = Ferrite Breab
JP? = Con6: Connector 6; Value: Connector 6
R45-R49 = Resistor: Published: 8-Jun-2000; LatestRevisionDate: 17-Jul-2002; LatestRevisionNote: Re-released for DXP Platform.; PackageReference: AXIAL-0.3; Publisher: Altium Limited
U? = MAX232: RS-232 Line Driver/Receiver

## Nets that join several sheets
+3V3: Power (6 pins), LCD_KEY (P1.5), FlowControl (8 pins), MainBoard (FB1.1 LED1.2 R19.2), RS485_MAX232 (JP?.4)
+5V: BusRCServo (16 pins), Power (6 pins), LCD_KEY (PLCD1.5 R22.2 VR1.1), RS485_MAX232 (C?#2.2 FB2.1 FB?.1)
+VOUT: Power (C8.1 C9.1 D1.1 U2.1), FlowControl (8 pins)
GND: BusRCServo (16 pins), Power (14 pins), LCD_KEY (5 pins), FlowControl (14 pins), MainBoard (14 pins), RS485_MAX232 (11 pins)
NetJP?_5: MainBoard (U1.46), RS485_MAX232 (JP?.5)
NetJP?_6: MainBoard (U1.49), RS485_MAX232 (JP?.6)
NetP1_2: LCD_KEY (P1.2), MainBoard (U1.24)
NetP1_3: LCD_KEY (P1.3), MainBoard (U1.21)
NetP1_4: LCD_KEY (P1.4), MainBoard (U1.20)
NetP2_1: BusRCServo (P2.1), MainBoard (R1.1)
NetP2_2: BusRCServo (P2.2), MainBoard (R6.1)
NetP2_7: BusRCServo (P2.7), MainBoard (R3.1)
NetP2_8: BusRCServo (P2.8), MainBoard (R7.1)
NetP2_13: BusRCServo (P2.13), MainBoard (R5.1)
NetP2_14: BusRCServo (P2.14), MainBoard (R9.1)
NetP3_1: BusRCServo (P3.1), MainBoard (R2.2)
NetP3_2: BusRCServo (P3.2), MainBoard (R15.1)
NetP3_7: BusRCServo (P3.7), MainBoard (R4.2)
NetP3_8: BusRCServo (P3.8), MainBoard (R17.1)
NetP3_13: BusRCServo (P3.13), MainBoard (R14.1)
NetP3_14: BusRCServo (P3.14), MainBoard (R18.1)
NetP4_1: BusRCServo (P4.1), MainBoard (R8.2)
NetP4_2: BusRCServo (P4.2), MainBoard (R12.2)
NetP4_7: BusRCServo (P4.7), MainBoard (R10.2)
NetP4_13: BusRCServo (P4.13), MainBoard (R11.2)
NetPLCD1_1: LCD_KEY (PLCD1.1), MainBoard (U1.43)
NetPLCD1_2: LCD_KEY (PLCD1.2), MainBoard (U1.44)
NetPLCD1_3: LCD_KEY (PLCD1.3), MainBoard (U1.45)
NetPLCD2_3: LCD_KEY (PLCD2.3), MainBoard (U1.11)
NetPLCD2_4: LCD_KEY (PLCD2.4), MainBoard (U1.10)
NetPLCD2_5: LCD_KEY (PLCD2.5), MainBoard (U1.9)
NetPLCD2_6: LCD_KEY (PLCD2.6), MainBoard (U1.8)
NetR23_1: LCD_KEY (R23.1), MainBoard (U1.25)
NetR43_1: MainBoard (R43.1), RS485_MAX232 (U?.12)
NetR44_1: MainBoard (R44.1), RS485_MAX232 (U?.11)
NetR50_2: MainBoard (R50.2), RS485_MAX232 (U10.1)
NetR51_1: MainBoard (R51.1), RS485_MAX232 (U10.4)
NetU1_29: FlowControl (U7.12), MainBoard (U1.29)
NetU1_30: FlowControl (U7.10), MainBoard (U1.30)
NetU1_33: FlowControl (U5.12), MainBoard (U1.33)
NetU1_34: FlowControl (U5.10), MainBoard (U1.34)
NetU1_55: MainBoard (U1.55), RS485_MAX232 (U10.2 U10.3)